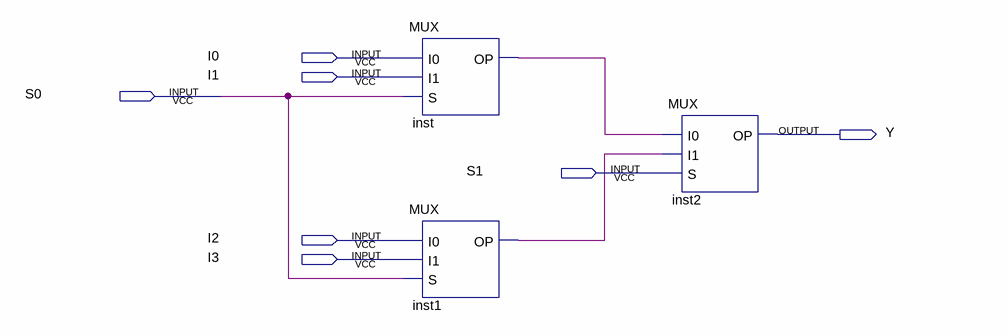
[diagram p0: schematic sheet]
// Quartus schematic mux42.bdf as structural Verilog: 3 symbols, 7 pins
module mux42 (
  input  I0,
  input  I1,
  input  S0,
  input  S1,
  input  I2,
  input  I3,
  output Y
);

  wire inst1_op, inst_op;

  MUX inst (.I0(I0), .I1(I1), .S(S0), .OP(inst_op));
  MUX inst1 (.I0(I2), .I1(I3), .S(S0), .OP(inst1_op));
  MUX inst2 (.I0(inst_op), .I1(inst1_op), .S(S1), .OP(Y));
endmodule
